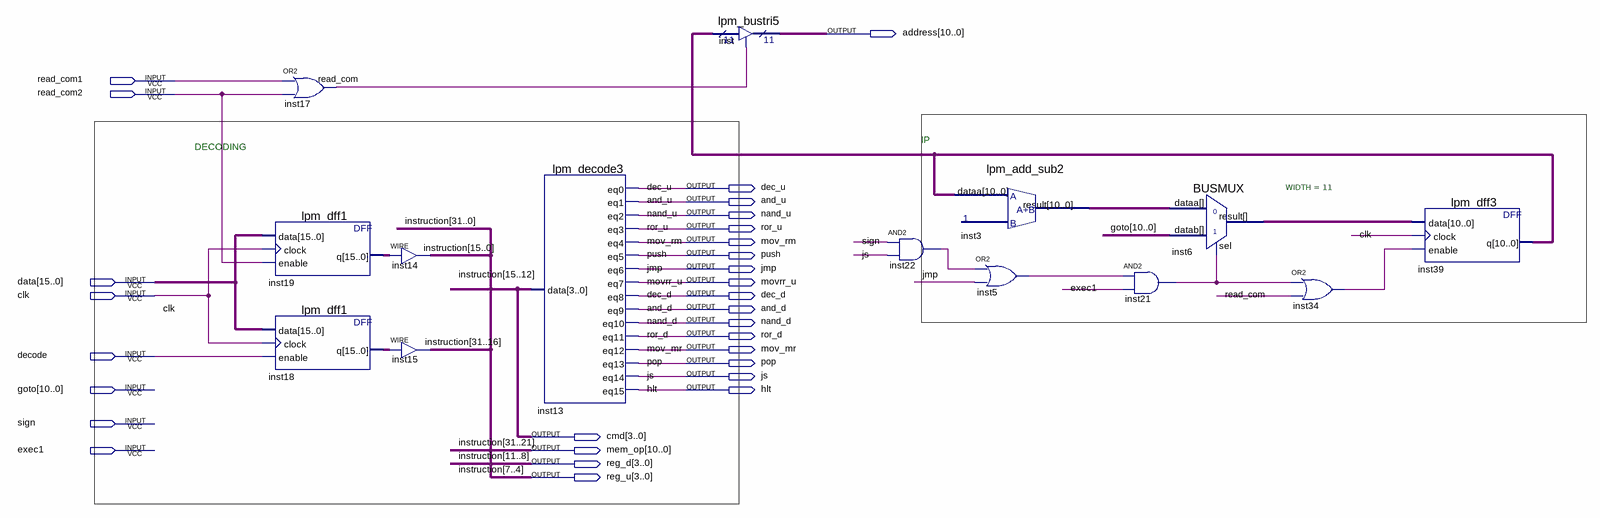
[diagram p0: schematic sheet]
// Quartus schematic if.bdf as structural Verilog: 14 symbols, 29 pins
module \if  (
  input  read_com1,
  input  read_com2,
  input  [15:0] data,
  input  clk,
  input  decode,
  input  [10:0] goto,
  input  sign,
  input  exec1,
  output [10:0] address,
  output dec_u,
  output and_u,
  output nand_u,
  output ror_u,
  output mov_rm,
  output push,
  output jmp,
  output movrr_u,
  output dec_d,
  output and_d,
  output nand_d,
  output ror_d,
  output mov_mr,
  output pop,
  output js,
  output hlt,
  output [3:0] cmd,
  output [10:0] mem_op,
  output [3:0] reg_d,
  output [3:0] reg_u
);

  wire inst5_out, inst21_out, inst22_out, inst34_out, read_com;
  wire [10:0] inst3_result, inst6_result, inst39_q;
  wire [15:0] inst18_q, inst19_q;
  wire [20:0] instruction;

  lpm_dff1 inst19 (.data(data), .clock(clk), .enable(read_com2), .q(inst19_q));
  lpm_dff1 inst18 (.data(data), .clock(clk), .enable(decode), .q(inst18_q));
  or inst17 (read_com, read_com1, read_com2);
  assign {cmd, reg_d, reg_u, instruction[3:0]} = inst19_q;  // WIRE inst14
  assign {mem_op, instruction[20:16]} = inst18_q;  // WIRE inst15
  lpm_decode3 inst13 (
    .data(cmd), .eq0(dec_u), .eq1(and_u), .eq2(nand_u), .eq3(ror_u), .eq4(mov_rm), .eq5(push), .eq6(jmp),
    .eq7(movrr_u), .eq8(dec_d), .eq9(and_d), .eq10(nand_d), .eq11(ror_d), .eq12(mov_mr), .eq13(pop),
    .eq14(js), .eq15(hlt));
  lpm_bustri5 inst (.enabledt(read_com), .data(inst39_q), .tridata(address));
  and inst22 (inst22_out, sign, js);
  lpm_add_sub2 inst3 (.dataa(inst39_q), .result(inst3_result));
  or inst5 (inst5_out, inst22_out, jmp);
  and inst21 (inst21_out, inst5_out, exec1);
  BUSMUX #(.WIDTH(11)) inst6 (.datab(goto), .sel(inst21_out), .dataa(inst3_result), .result(inst6_result));
  or inst34 (inst34_out, inst21_out, read_com);
  lpm_dff3 inst39 (.data(inst6_result), .clock(clk), .enable(inst34_out), .q(inst39_q));

  // Other names for the same wires on the sheet: instruction (some bits) = {mem_op, cmd, reg_d, reg_u}

  // Notes on the sheet:
  //   IP
  //   DECODING
endmodule
